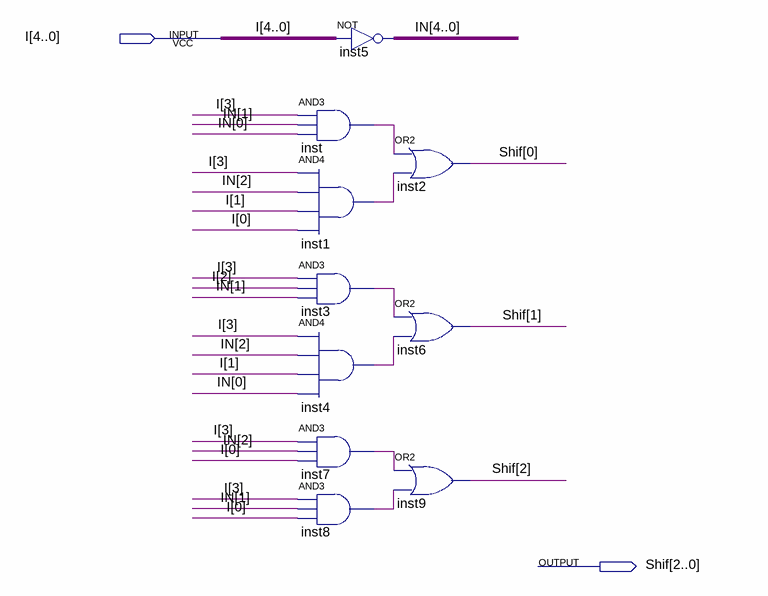
[diagram p0: schematic sheet]
// Quartus schematic ShiftOP.bdf as structural Verilog: 10 symbols, 2 pins
module ShiftOP (
  input  [4:0] I,
  output [2:0] Shif
);

  wire inst1_out, inst3_out, inst4_out, inst7_out, inst8_out, inst_out;
  wire [4:0] IN;

  assign IN = ~I;  // NOT inst5, 5 bits wide
  and inst (inst_out, I[3], IN[1], IN[0]);
  and inst1 (inst1_out, I[3], IN[2], I[1], I[0]);
  and inst3 (inst3_out, I[3], I[2], IN[1]);
  and inst4 (inst4_out, I[3], IN[2], I[1], IN[0]);
  and inst7 (inst7_out, I[3], IN[2], I[0]);
  and inst8 (inst8_out, I[3], IN[1], I[0]);
  or inst2 (Shif[0], inst_out, inst1_out);
  or inst6 (Shif[1], inst3_out, inst4_out);
  or inst9 (Shif[2], inst7_out, inst8_out);
endmodule
